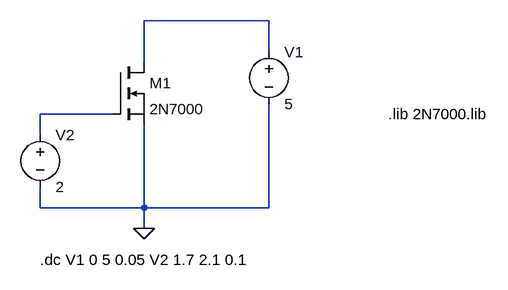
[diagram p0: schematic 2N7000_2.asc]
2N7000_2.asc, the LTspice schematic file:
Version 4
SHEET 1 880 680
WIRE 400 64 208 64
WIRE 400 112 400 64
WIRE 208 128 208 64
WIRE 160 208 48 208
WIRE 48 240 48 208
WIRE 48 352 48 320
WIRE 208 352 208 224
WIRE 208 352 48 352
WIRE 400 352 400 192
WIRE 400 352 208 352
WIRE 208 384 208 352
FLAG 208 384 0
SYMBOL nmos 160 128 R0
SYMATTR InstName M1
SYMATTR Value 2N7000
SYMATTR Prefix X
SYMBOL voltage 400 96 R0
WINDOW 123 0 0 Left 0
WINDOW 39 0 0 Left 0
SYMATTR InstName V1
SYMATTR Value 5
SYMBOL voltage 48 224 R0
WINDOW 123 0 0 Left 0
WINDOW 39 0 0 Left 0
SYMATTR InstName V2
SYMATTR Value 2
TEXT 584 208 Left 2 !.lib 2N7000.lib
TEXT 48 432 Left 2 !.dc V1 0 5 0.05 V2 1.7 2.1 0.1

The netlist it stands for:
* 2N7000_2.asc
XM1 N001 N002 0 2N7000  ; pins D G S
V1 N001 0 5
V2 N002 0 2
.lib 2N7000.lib
.dc V1 0 5 0.05 V2 1.7 2.1 0.1
.backanno
.end